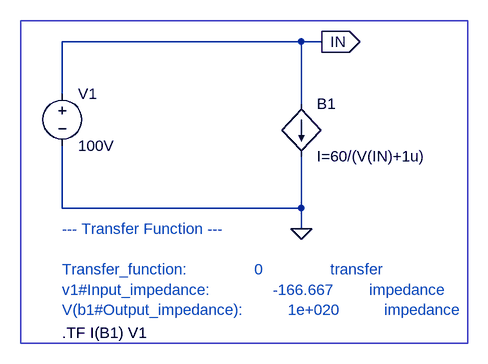
[diagram p0: schematic Switch-Mode Power Supplies - Basso- Figure 1-53.asc]
Switch-Mode Power Supplies - Basso- Figure 1-53.asc, the LTspice schematic file:
Version 4
SHEET 1 880 1052
WIRE -1520 -832 -1888 -832
WIRE -1488 -832 -1520 -832
WIRE -1888 -752 -1888 -832
WIRE -1520 -736 -1520 -832
WIRE -1888 -576 -1888 -672
WIRE -1520 -576 -1520 -656
WIRE -1520 -576 -1888 -576
WIRE -1520 -544 -1520 -576
FLAG -1520 -544 0
FLAG -1488 -832 IN
IOPIN -1488 -832 Out
SYMBOL voltage -1888 -768 R0
WINDOW 123 0 0 Left 0
WINDOW 39 0 0 Left 0
SYMATTR InstName V1
SYMATTR Value 100V
SYMBOL bi -1520 -736 R0
SYMATTR InstName B1
SYMATTR Value I=60/(V(IN)+1u)
TEXT -1888 -384 Left 0 !.TF I(B1) V1
TEXT -1888 -544 Left 0 ;--- Transfer Function ---\n \nTransfer_function:               0               transfer\nv1#Input_impedance:              -166.667        impedance\nV(b1#Output_impedance):          1e+020          impedance
RECTANGLE Normal -1952 -864 -1264 -368

The netlist it stands for:
* Switch-Mode Power Supplies - Basso- Figure 1-53.asc
V1 IN 0 100V
B1 IN 0 I=60/(V(IN)+1u)
.TF I(B1) V1
* --- Transfer Function ---
* Transfer_function:               0               transfer
* v1#Input_impedance:              -166.667        impedance
* V(b1#Output_impedance):          1e+020          impedance
.backanno
.end